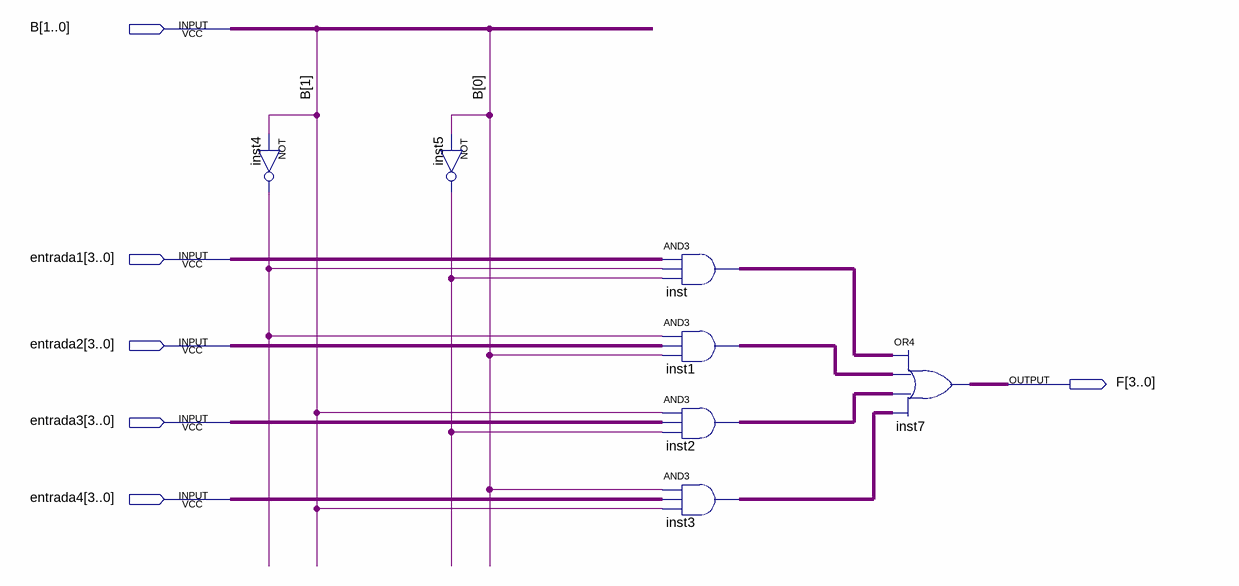
[diagram p0: schematic sheet]
// Quartus schematic circ2.bdf as structural Verilog: 7 symbols, 6 pins
module circ2 (
  input  [1:0] B,
  input  [3:0] entrada1,
  input  [3:0] entrada2,
  input  [3:0] entrada3,
  input  [3:0] entrada4,
  output [3:0] F
);

  wire inst4_out, inst5_out;
  wire [3:0] inst1_out, inst2_out, inst3_out, inst_out;

  not inst4 (inst4_out, B[1]);
  not inst5 (inst5_out, B[0]);
  assign inst_out = entrada1 & {4{inst4_out}} & {4{inst5_out}};  // AND3 inst, 4 bits wide
  assign inst1_out = {4{inst4_out}} & entrada2 & {4{B[0]}};  // AND3 inst1, 4 bits wide
  assign inst2_out = {4{B[1]}} & entrada3 & {4{inst5_out}};  // AND3 inst2, 4 bits wide
  assign inst3_out = {4{B[0]}} & entrada4 & {4{B[1]}};  // AND3 inst3, 4 bits wide
  assign F = inst_out | inst1_out | inst2_out | inst3_out;  // OR4 inst7, 4 bits wide
endmodule
